# Altium schematic sheet IN_A.SchDoc
size 420 x 297 mm; Author: ALTIUM GOSTBOM2.0 KEV; SheetNumber: 2; SheetTotal: 3; Наименование_организации: НИТУ МИСИС; п_Разраб_Р: Хрущев А.С.
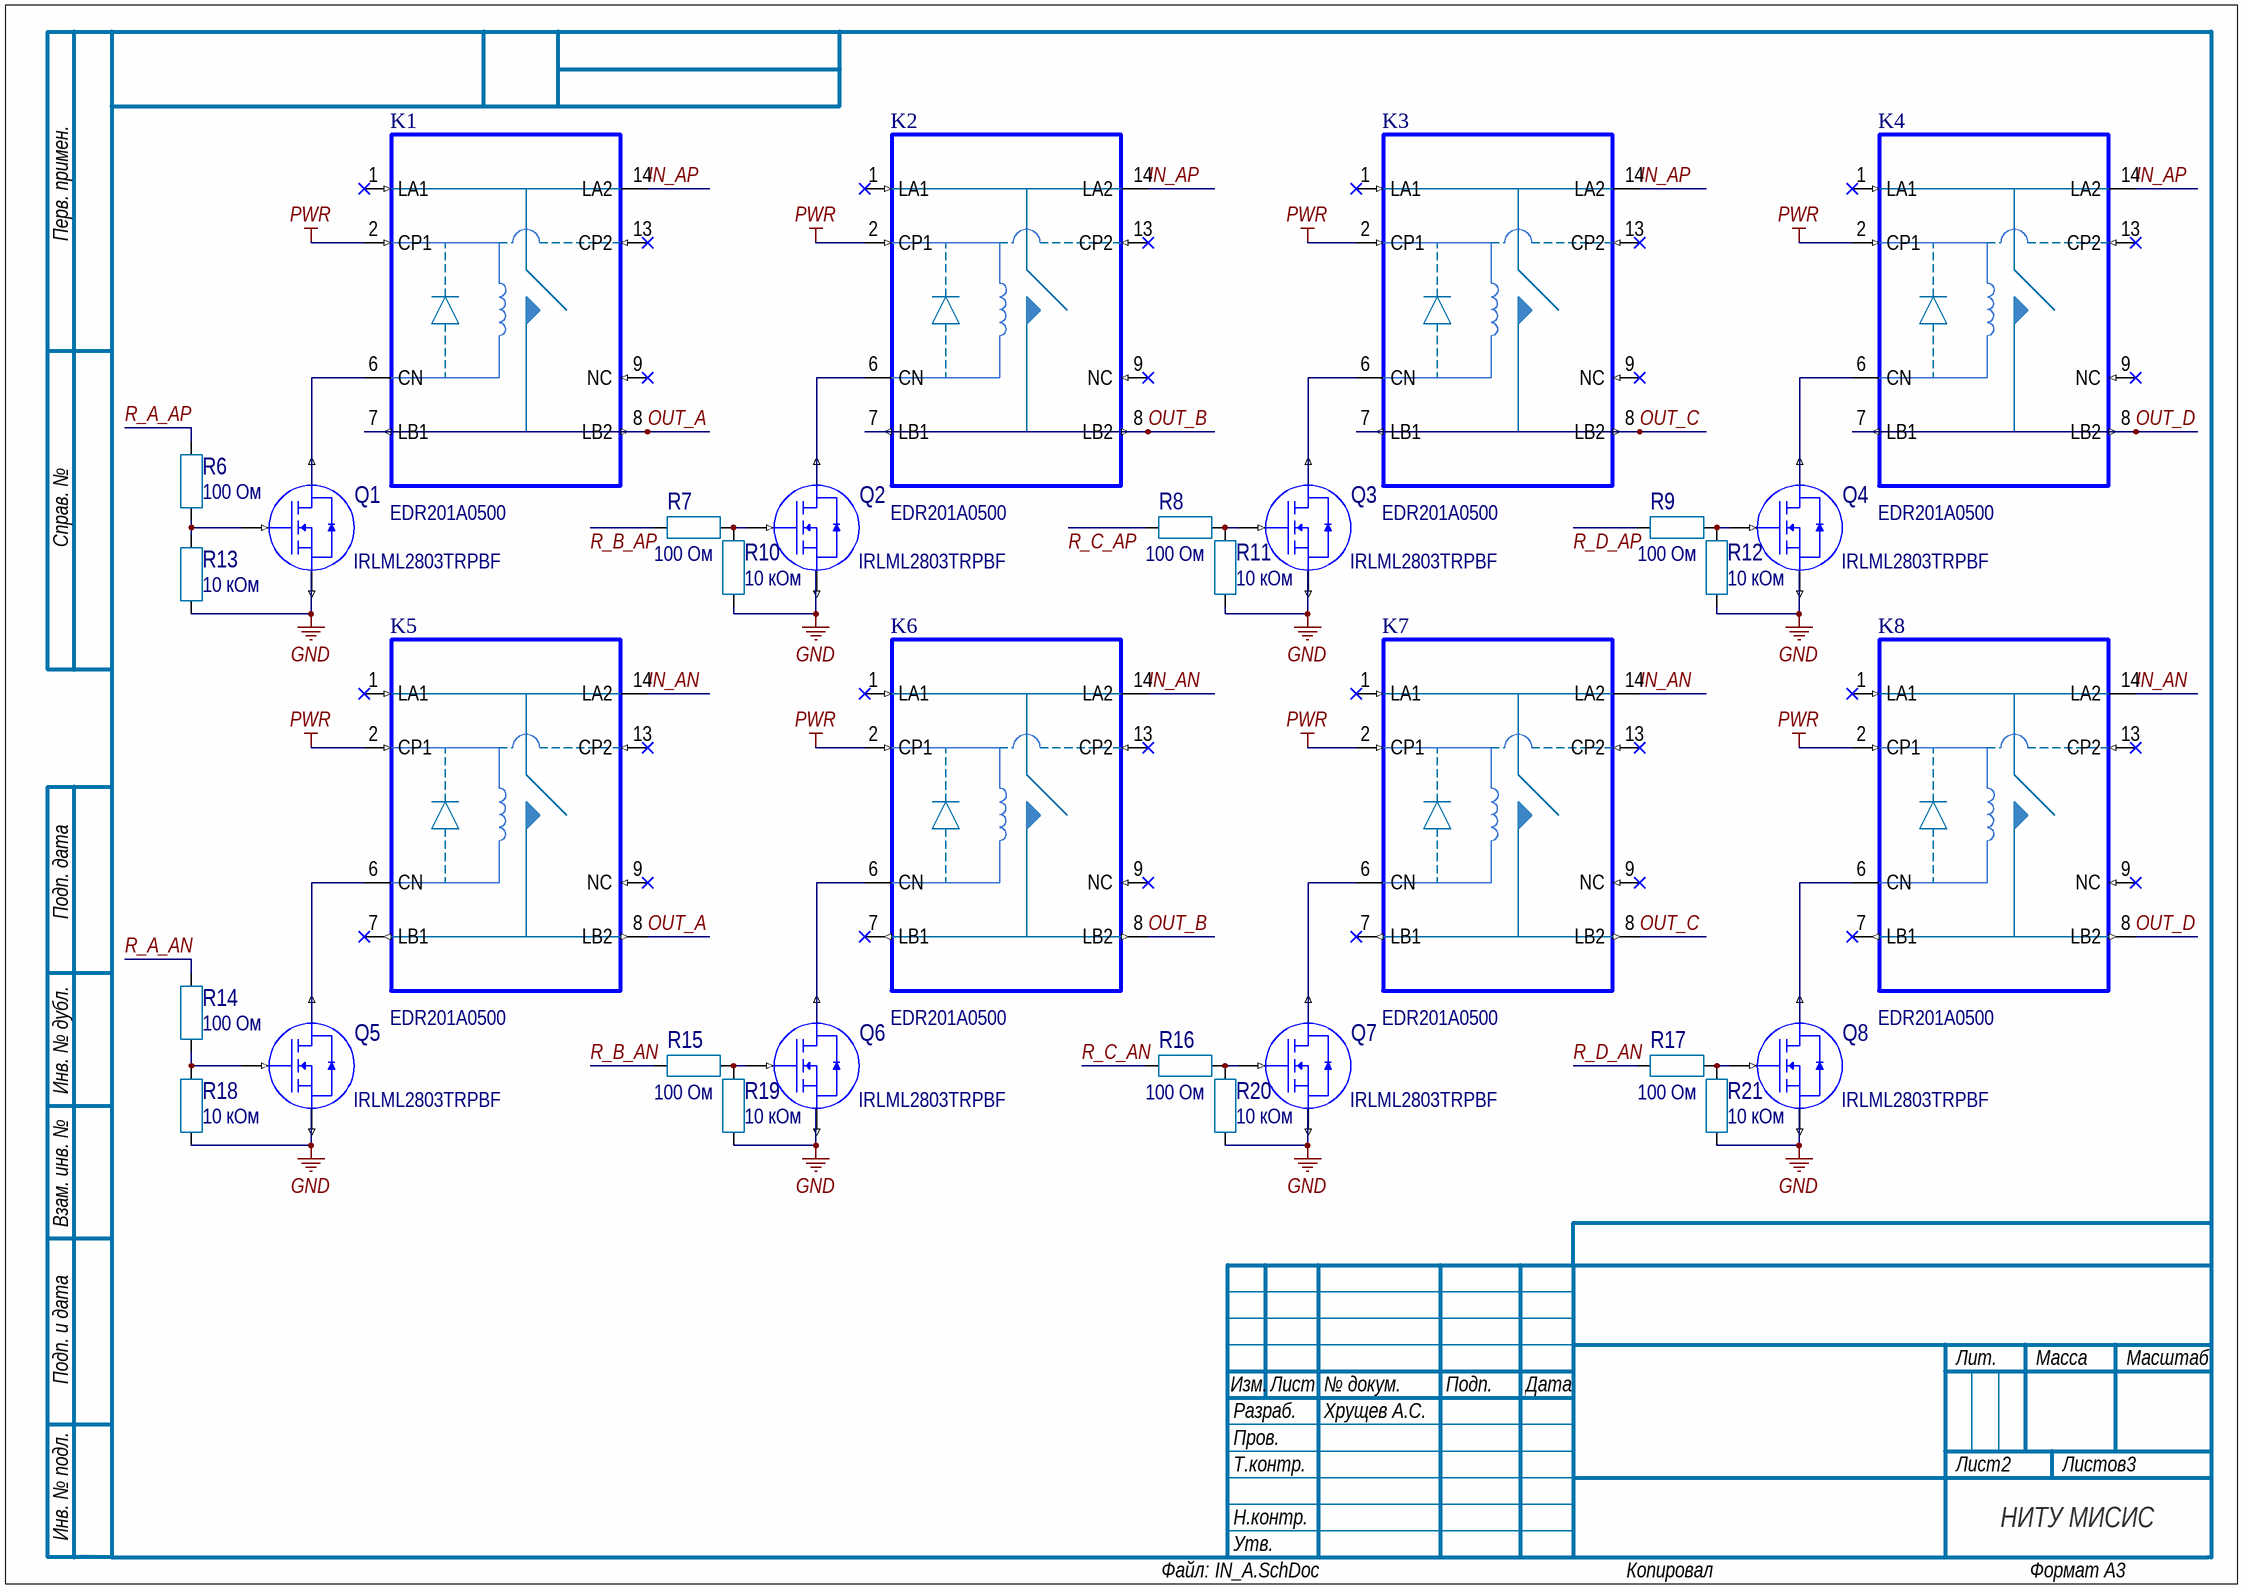
[diagram p0: IN_A.SchDoc]

## Parts
K1  EDR201A0500  [DIP14]
K2  EDR201A0500  [DIP14]
K3  EDR201A0500  [DIP14]
K4  EDR201A0500  [DIP14]
K5  EDR201A0500  [DIP14]
K6  EDR201A0500  [DIP14]
K7  EDR201A0500  [DIP14]
K8  EDR201A0500  [DIP14]
Q1  IRLML2803TRPBF  [SOT23-3]
Q2  IRLML2803TRPBF  [SOT23-3]
Q3  IRLML2803TRPBF  [SOT23-3]
Q4  IRLML2803TRPBF  [SOT23-3]
Q5  IRLML2803TRPBF  [SOT23-3]
Q6  IRLML2803TRPBF  [SOT23-3]
Q7  IRLML2803TRPBF  [SOT23-3]
Q8  IRLML2803TRPBF  [SOT23-3]
R6  100 Ом  [R0805]
R7  100 Ом  [R0805]
R8  100 Ом  [R0805]
R9  100 Ом  [R0805]
R10  10 кОм  [R0805]
R11  10 кОм  [R0805]
R12  10 кОм  [R0805]
R13  10 кОм  [R0805]
R14  100 Ом  [R0805]
R15  100 Ом  [R0805]
R16  100 Ом  [R0805]
R17  100 Ом  [R0805]
R18  10 кОм  [R0805]
R19  10 кОм  [R0805]
R20  10 кОм  [R0805]
R21  10 кОм  [R0805]

## Nets
GND: Q1.2(S) Q2.2(S) Q3.2(S) Q4.2(S) Q5.2(S) Q6.2(S) Q7.2(S) Q8.2(S) R10.1 R11.1 R12.1 R13.1 R18.1 R19.1 R20.1 R21.1
PWR: K1.2(CP1) K2.2(CP1) K3.2(CP1) K4.2(CP1) K5.2(CP1) K6.2(CP1) K7.2(CP1) K8.2(CP1)
IN_AN: K5.14(LA2) K6.14(LA2) K7.14(LA2) K8.14(LA2)
IN_AP: K1.14(LA2) K2.14(LA2) K3.14(LA2) K4.14(LA2)
OUT_A: K1.7(LB1) K1.8(LB2) K5.8(LB2)
OUT_B: K2.7(LB1) K2.8(LB2) K6.8(LB2)
OUT_C: K3.7(LB1) K3.8(LB2) K7.8(LB2)
OUT_D: K4.7(LB1) K4.8(LB2) K8.8(LB2)
R_A_AN: R14.2
R_A_AP: R6.2
R_B_AN: R15.1
R_B_AP: R7.1
R_C_AN: R16.1
R_C_AP: R8.1
R_D_AN: R17.1
R_D_AP: R9.1
NetK1_6: K1.6(CN) Q1.3(D)
NetK2_6: K2.6(CN) Q2.3(D)
NetK3_6: K3.6(CN) Q3.3(D)
NetK4_6: K4.6(CN) Q4.3(D)
NetK5_6: K5.6(CN) Q5.3(D)
NetK6_6: K6.6(CN) Q6.3(D)
NetK7_6: K7.6(CN) Q7.3(D)
NetK8_6: K8.6(CN) Q8.3(D)
NetQ1_1: Q1.1(G) R6.1 R13.2
NetQ2_1: Q2.1(G) R7.2 R10.2
NetQ3_1: Q3.1(G) R8.2 R11.2
NetQ4_1: Q4.1(G) R9.2 R12.2
NetQ5_1: Q5.1(G) R14.1 R18.2
NetQ6_1: Q6.1(G) R15.2 R19.2
NetQ7_1: Q7.1(G) R16.2 R20.2
NetQ8_1: Q8.1(G) R17.2 R21.2

Not connected (* = marked no-connect by the designer): K1 1(LA1)* 9(NC)* 13(CP2)*; K2 1(LA1)* 9(NC)* 13(CP2)*; K3 1(LA1)* 9(NC)* 13(CP2)*; K4 1(LA1)* 9(NC)* 13(CP2)*; K5 1(LA1)* 7(LB1)* 9(NC)* 13(CP2)*; K6 1(LA1)* 7(LB1)* 9(NC)* 13(CP2)*; K7 1(LA1)* 7(LB1)* 9(NC)* 13(CP2)*; K8 1(LA1)* 7(LB1)* 9(NC)* 13(CP2)*

## Notes on the sheet
- Перв. примен.
- Справ. №
- Подп. дата
- Инв. № дубл.
- Взам. инв. №
- Подп. и дата
- Изм.
- Разраб.
- Лист
- № докум.
- Подп.
- Дата
- Лит.
- Масса
- Масштаб
- Пров.
- Т.контр.
- Листов
- Инв. № подл.
- Н.контр.
- Утв.
- ALTIUM GOSTBOM2.0 KEV
- Файл:
- Копировал
- Формат А3

## Library data of the parts
K1-K8 = EDR201A0500: Реле герконовое 5V / 1A,100V; MF: Fairchild Semiconductor; MP: MM74HC32N; SnapEDA_Link: https://www.snapeda.com/parts/MM74HC32N/Fairchild+Imaging/view-part/?ref=snap; Package: DIP-14 Fairchild Semiconductor; Value: *; Check_prices: https://www.snapeda.com/parts/MM74HC32N/Fairchild+Imaging/view-part/?ref=eda
Q1-Q8 = IRLML2803TRPBF: N-MOSFET 30V 1.2A SOT23; Supplier 1: Future Electronics; Supplier Part Number 1: 1173882
R6-R9 R14-R17 = R1_POSTOYANNYJ: Резистор 100 Ом; Value: 100 Ом
R10-R13 R18-R21 = R1_POSTOYANNYJ: Резистор 100 Ом; Value: 100 Ом